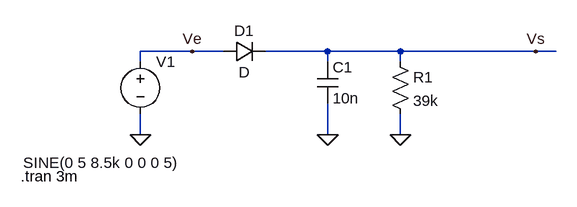
[diagram p0: schematic detecteur de crete.asc]
detecteur de crete.asc, the LTspice schematic file:
Version 4
SHEET 1 880 680
WIRE 128 144 48 144
WIRE 176 144 128 144
WIRE 336 144 240 144
WIRE 448 144 336 144
WIRE 656 144 448 144
WIRE 688 144 656 144
WIRE 48 160 48 144
WIRE 336 160 336 144
WIRE 448 160 448 144
WIRE 48 272 48 240
WIRE 336 272 336 224
WIRE 448 272 448 240
FLAG 448 272 0
FLAG 48 272 0
FLAG 336 272 0
FLAG 128 144 Ve
FLAG 656 144 Vs
SYMBOL voltage 48 144 R0
WINDOW 3 -180 171 Left 2
WINDOW 123 0 0 Left 2
WINDOW 39 0 0 Left 2
SYMATTR Value SINE(0 5 8.5k 0 0 0 5)
SYMATTR InstName V1
SYMBOL diode 176 160 R270
WINDOW 0 32 32 VTop 2
WINDOW 3 0 32 VBottom 2
SYMATTR InstName D1
SYMBOL cap 320 160 R0
SYMATTR InstName C1
SYMATTR Value 10n
SYMBOL res 432 144 R0
SYMATTR InstName R1
SYMATTR Value 39k
TEXT -136 336 Left 2 !.tran 3m

The netlist it stands for:
* detecteur de crete.asc
V1 Ve 0 SINE(0 5 8.5k 0 0 0 5)
D1 Ve Vs D
C1 Vs 0 10n
R1 Vs 0 39k
.model D D
.lib standard.dio
.tran 3m
.backanno
.end

* Results of the author's LTspice run, read from the files saved beside the schematic
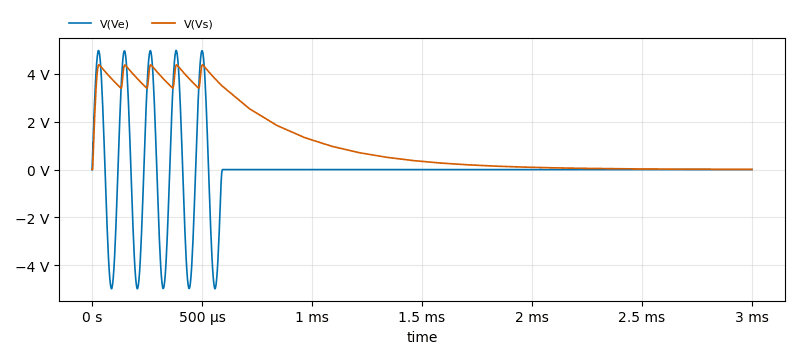
[diagram p1: Transient Analysis of detecteur de crete.asc, plotted from the saved traces]
* Transient Analysis, 1 run:
*   V(Ve): min -4.985 V, max 4.986 V, average -272.7 µV, rms 1.557 V, last 0 V
*   V(Vs): min 0 V, max 4.384 V, average 1.212 V, rms 1.94 V, last 7.267 mV